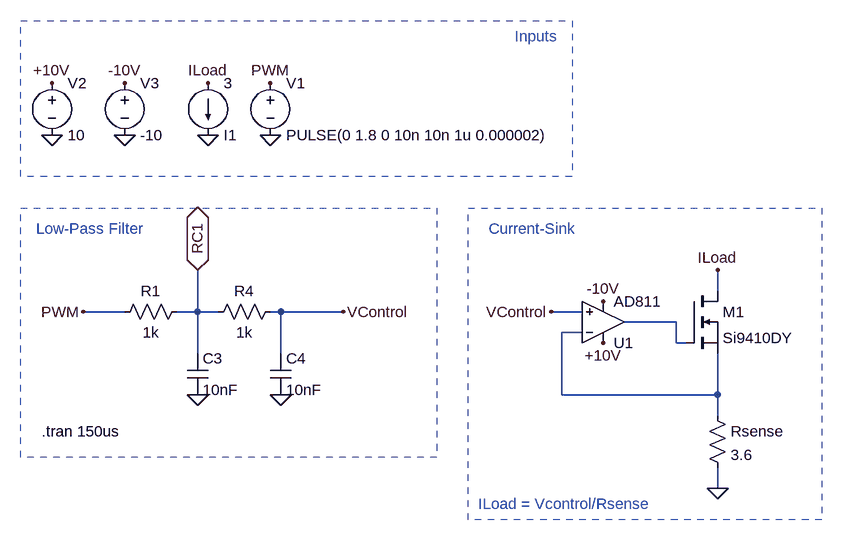
[diagram p0: schematic LTSpice-MainSimulationOfTheCircuit.asc]
LTSpice-MainSimulationOfTheCircuit.asc, the LTspice schematic file:
Version 4.1
SHEET 1 1804 852
WIRE 848 -144 848 -176
WIRE -64 -112 -128 -112
WIRE 48 -112 48 -176
WIRE 48 -112 16 -112
WIRE 80 -112 48 -112
WIRE 176 -112 160 -112
WIRE 272 -112 176 -112
WIRE 640 -112 592 -112
WIRE 784 -96 704 -96
WIRE 640 -80 608 -80
WIRE 784 -64 784 -96
WIRE 800 -64 784 -64
WIRE 48 -48 48 -112
WIRE 176 -48 176 -112
WIRE 608 16 608 -80
WIRE 848 16 848 -48
WIRE 848 16 608 16
WIRE 848 48 848 16
WIRE 848 160 848 128
FLAG 160 -384 0
FLAG -176 -384 0
FLAG -64 -384 0
FLAG -176 -464 +10V
FLAG -64 -464 -10V
FLAG 672 -64 +10V
FLAG 672 -128 -10V
FLAG 848 160 0
FLAG 64 -384 0
FLAG 64 -464 ILoad
FLAG 848 -176 ILoad
FLAG 592 -112 VControl
FLAG 48 16 0
FLAG 176 16 0
FLAG 272 -112 VControl
FLAG 160 -464 PWM
FLAG -128 -112 PWM
FLAG 48 -176 RC1
IOPIN 48 -176 BiDir
SYMBOL voltage 160 -480 R0
WINDOW 123 0 0 Left 0
WINDOW 39 0 0 Left 0
SYMATTR InstName V1
SYMATTR Value PULSE(0 1.8 0 10n 10n 1u 0.000002)
SYMBOL OpAmps\\AD811 672 -32 M180
SYMATTR InstName U1
SYMBOL voltage -176 -480 R0
WINDOW 123 0 0 Left 0
WINDOW 39 0 0 Left 0
SYMATTR InstName V2
SYMATTR Value 10
SYMBOL voltage -64 -480 R0
WINDOW 123 0 0 Left 0
WINDOW 39 0 0 Left 0
SYMATTR InstName V3
SYMATTR Value -10
SYMBOL nmos 800 -144 R0
SYMATTR InstName M1
SYMATTR Value Si9410DY
SYMBOL res 832 32 R0
SYMATTR InstName Rsense
SYMATTR Value 3.6
SYMBOL current 64 -464 R0
WINDOW 0 24 80 Left 2
WINDOW 3 24 0 Left 2
WINDOW 123 0 0 Left 0
WINDOW 39 0 0 Left 0
SYMATTR InstName I1
SYMATTR Value 3
SYMBOL res -80 -96 R270
WINDOW 0 32 56 VTop 2
WINDOW 3 0 56 VBottom 2
SYMATTR InstName R1
SYMATTR Value 1k
SYMBOL cap 32 -48 R0
SYMATTR InstName C3
SYMATTR Value 10nF
SYMBOL res 176 -128 R90
WINDOW 0 0 56 VBottom 2
WINDOW 3 32 56 VTop 2
SYMATTR InstName R4
SYMATTR Value 1k
SYMBOL cap 160 -48 R0
SYMATTR InstName C4
SYMATTR Value 10nF
TEXT 480 184 Left 2 ;ILoad = Vcontrol/Rsense
TEXT 496 -240 Left 2 ;Current-Sink
TEXT -192 72 Left 2 !.tran 150us
TEXT 536 -536 Left 2 ;Inputs
TEXT -200 -240 Left 2 ;Low-Pass Filter
RECTANGLE Normal 1008 208 464 -272 1
RECTANGLE Normal 416 112 -224 -272 1
RECTANGLE Normal 624 -320 -224 -560 1

The netlist it stands for:
* LTSpice-MainSimulationOfTheCircuit.asc
V1 PWM 0 PULSE(0 1.8 0 10n 10n 1u 0.000002)
X§U1 VControl N002 +10V -10V N001 AD811  ; pins In+ In- V+ V- OUT
V2 +10V 0 10
V3 -10V 0 -10
M1 ILoad N001 N002 N002 Si9410DY
Rsense N002 0 3.6
I1 ILoad 0 3
R1 PWM RC1 1k
C3 RC1 0 10nF
R4 VControl RC1 1k
C4 VControl 0 10nF
.model NMOS NMOS
.model PMOS PMOS
.lib standard.mos
* ILoad = Vcontrol/Rsense
* Current-Sink
.tran 150us
* Inputs
* Low-Pass Filter
.backanno
.end